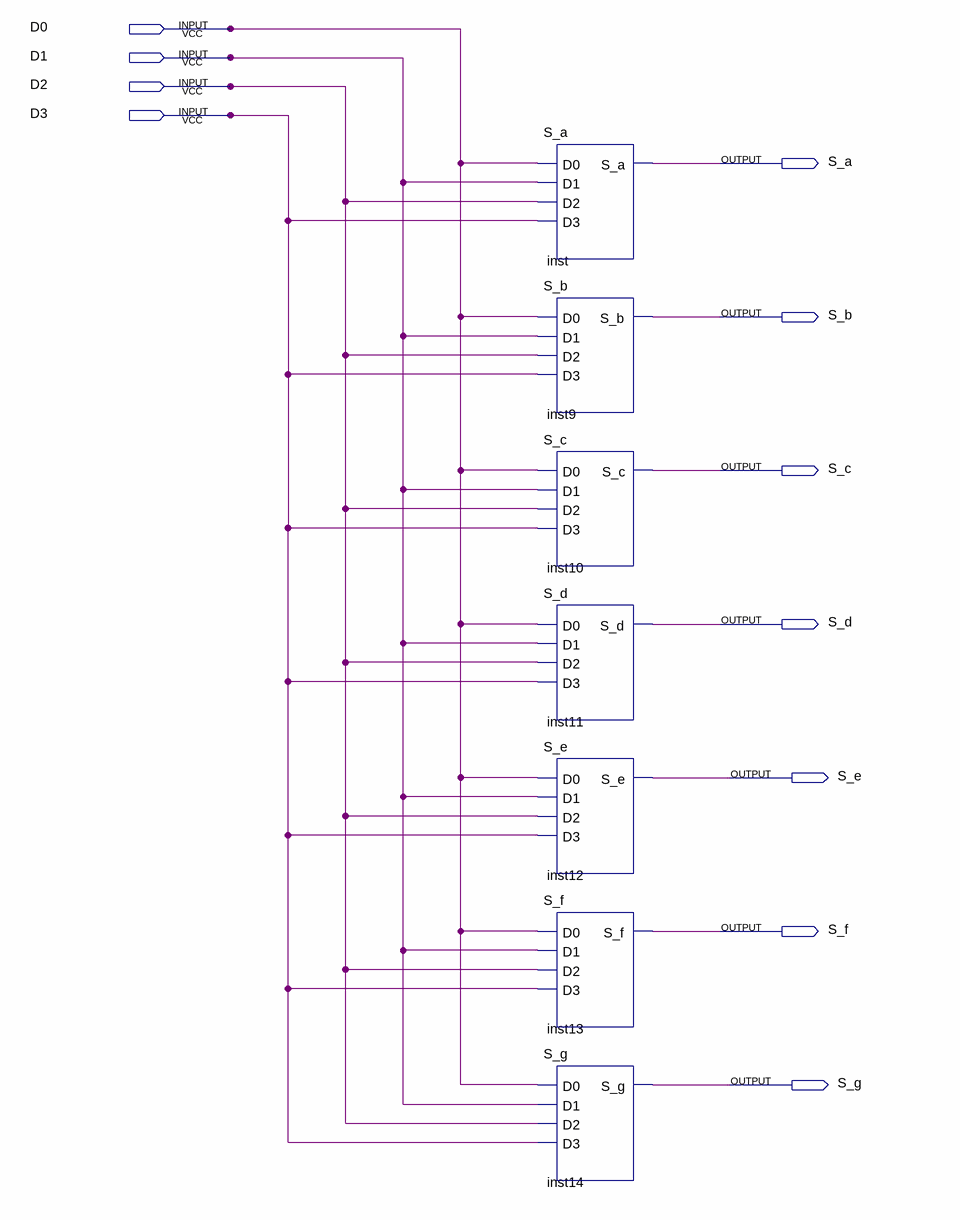
[diagram p0: schematic sheet]
// Quartus schematic seven_seg_display.bdf as structural Verilog: 7 symbols, 11 pins
module seven_seg_display (
  input  D0,
  input  D1,
  input  D2,
  input  D3,
  output S_a,
  output S_b,
  output S_c,
  output S_d,
  output S_e,
  output S_f,
  output S_g
);

  S_a inst (.D0(D0), .D1(D1), .D2(D2), .D3(D3), .S_a(S_a));
  S_b inst9 (.D0(D0), .D1(D1), .D2(D2), .D3(D3), .S_b(S_b));
  S_c inst10 (.D0(D0), .D1(D1), .D2(D2), .D3(D3), .S_c(S_c));
  S_d inst11 (.D0(D0), .D1(D1), .D2(D2), .D3(D3), .S_d(S_d));
  S_e inst12 (.D0(D0), .D1(D1), .D2(D2), .D3(D3), .S_e(S_e));
  S_f inst13 (.D0(D0), .D1(D1), .D2(D2), .D3(D3), .S_f(S_f));
  S_g inst14 (.D0(D0), .D1(D1), .D2(D2), .D3(D3), .S_g(S_g));
endmodule
